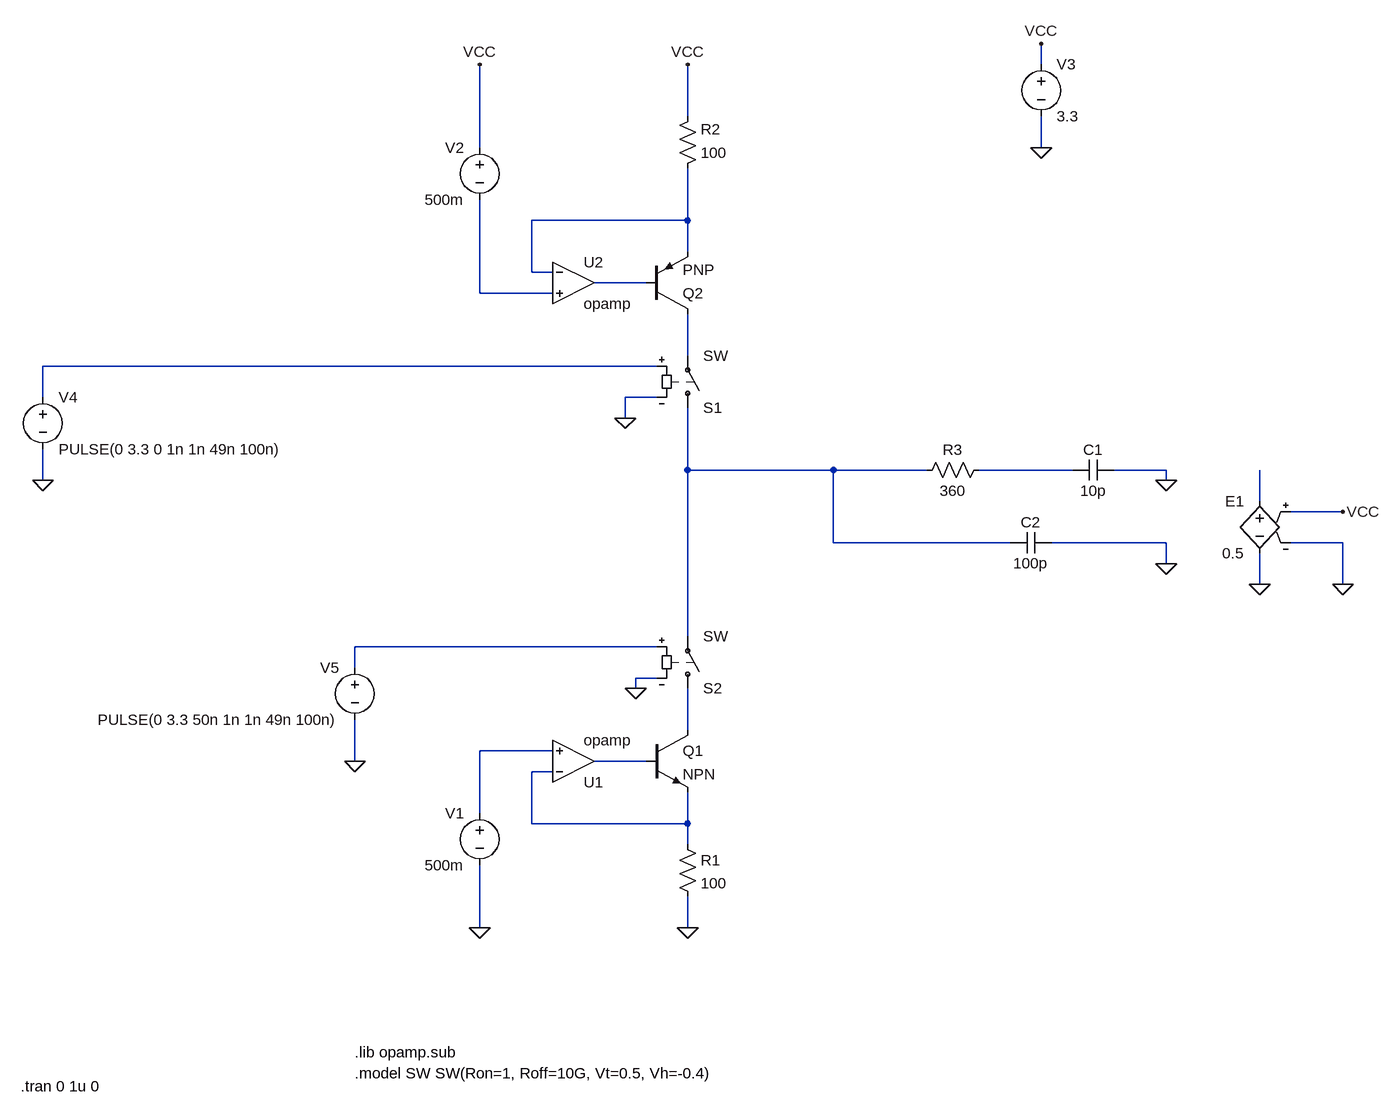
[diagram p0: schematic Type_II_PFD_Sim_Transient.asc]
Type_II_PFD_Sim_Transient.asc, the LTspice schematic file:
Version 4
SHEET 1 1520 692
WIRE 992 -896 992 -928
WIRE 448 -816 448 -896
WIRE 128 -768 128 -896
WIRE 992 -768 992 -816
WIRE 448 -656 448 -736
WIRE 448 -656 208 -656
WIRE 448 -608 448 -656
WIRE 208 -576 208 -656
WIRE 240 -576 208 -576
WIRE 384 -560 304 -560
WIRE 128 -544 128 -688
WIRE 240 -544 128 -544
WIRE 448 -448 448 -512
WIRE 400 -432 -544 -432
WIRE -544 -384 -544 -432
WIRE 400 -384 352 -384
WIRE 352 -352 352 -384
WIRE 448 -272 448 -368
WIRE 672 -272 448 -272
WIRE 816 -272 672 -272
WIRE 1040 -272 896 -272
WIRE 1184 -272 1104 -272
WIRE -544 -256 -544 -304
WIRE 1184 -256 1184 -272
WIRE 1328 -224 1328 -272
WIRE 1456 -208 1376 -208
WIRE 672 -160 672 -272
WIRE 944 -160 672 -160
WIRE 1184 -160 1008 -160
WIRE 1456 -160 1376 -160
WIRE 1184 -128 1184 -160
WIRE 1328 -96 1328 -144
WIRE 1456 -96 1456 -160
WIRE 448 -16 448 -272
WIRE 400 0 -64 0
WIRE -64 32 -64 0
WIRE 400 48 368 48
WIRE 368 64 368 48
WIRE 448 128 448 64
WIRE 240 160 128 160
WIRE -64 176 -64 112
WIRE 384 176 304 176
WIRE 240 192 208 192
WIRE 128 256 128 160
WIRE 208 272 208 192
WIRE 448 272 448 224
WIRE 448 272 208 272
WIRE 448 304 448 272
WIRE 128 432 128 336
WIRE 448 432 448 384
FLAG 448 432 0
FLAG 128 432 0
FLAG 128 -896 VCC
FLAG 448 -896 VCC
FLAG 992 -768 0
FLAG 992 -928 VCC
FLAG 1328 -96 0
FLAG 1456 -96 0
FLAG 1456 -208 VCC
FLAG 352 -352 0
FLAG 368 64 0
FLAG -544 -256 0
FLAG -64 176 0
FLAG 1184 -256 0
FLAG 1184 -128 0
SYMBOL Opamps\\opamp 272 240 M180
SYMATTR InstName U1
SYMATTR SpiceLine Aol=10Meg
SYMATTR SpiceLine2 GBW=10G
SYMBOL npn 384 128 R0
SYMATTR InstName Q1
SYMBOL res 432 288 R0
SYMATTR InstName R1
SYMATTR Value 100
SYMBOL voltage 128 240 M0
WINDOW 123 0 0 Left 0
WINDOW 39 0 0 Left 0
SYMATTR InstName V1
SYMATTR Value 500m
SYMBOL Opamps\\opamp 272 -624 R0
SYMATTR InstName U2
SYMATTR SpiceLine Aol=10Meg
SYMATTR SpiceLine2 GBW=10G
SYMBOL res 432 -720 M180
WINDOW 0 36 76 Left 2
WINDOW 3 36 40 Left 2
SYMATTR InstName R2
SYMATTR Value 100
SYMBOL voltage 128 -784 M0
WINDOW 123 0 0 Left 0
WINDOW 39 0 0 Left 0
SYMATTR InstName V2
SYMATTR Value 500m
SYMBOL pnp 384 -512 M180
SYMATTR InstName Q2
SYMBOL sw 448 -352 M180
SYMATTR InstName S1
SYMBOL sw 448 80 M180
SYMATTR InstName S2
SYMBOL voltage 992 -912 R0
SYMATTR InstName V3
SYMATTR Value 3.3
SYMBOL e 1328 -240 M0
SYMATTR InstName E1
SYMATTR Value 0.5
SYMBOL voltage -544 -400 R0
WINDOW 123 0 0 Left 0
WINDOW 39 0 0 Left 0
SYMATTR InstName V4
SYMATTR Value PULSE(0 3.3 0 1n 1n 49n 100n)
SYMBOL voltage -64 16 M0
WINDOW 123 0 0 Left 0
WINDOW 39 0 0 Left 0
SYMATTR InstName V5
SYMATTR Value PULSE(0 3.3 50n 1n 1n 49n 100n)
SYMBOL res 800 -256 R270
WINDOW 0 32 56 VTop 2
WINDOW 3 0 56 VBottom 2
SYMATTR InstName R3
SYMATTR Value 360
SYMBOL cap 1104 -288 R90
WINDOW 0 0 32 VBottom 2
WINDOW 3 32 32 VTop 2
SYMATTR InstName C1
SYMATTR Value 10p
SYMBOL cap 1008 -176 R90
WINDOW 0 0 32 VBottom 2
WINDOW 3 32 32 VTop 2
SYMATTR InstName C2
SYMATTR Value 100p
TEXT -64 624 Left 2 !.lib opamp.sub
TEXT -64 656 Left 2 !.model SW SW(Ron=1, Roff=10G, Vt=0.5, Vh=-0.4)
TEXT -578 676 Left 2 !.tran 0 1u 0

The netlist it stands for:
* Type_II_PFD_Sim_Transient.asc
XU1 N013 N011 N012 opamp Aol=10Meg GBW=10G  ; pins invin noninvin out
Q1 N010 N012 N013 0 NPN
R1 N013 0 100
V1 N011 0 500m
XU2 N001 N003 N002 opamp Aol=10Meg GBW=10G  ; pins invin noninvin out
R2 N001 VCC 100
V2 VCC N003 500m
Q2 N004 N002 N001 0 PNP
S1 N006 N004 N005 0 SW
S2 N010 N006 N009 0 SW
V3 VCC 0 3.3
E1 N008 0 VCC 0 0.5
V4 N005 0 PULSE(0 3.3 0 1n 1n 49n 100n)
V5 N009 0 PULSE(0 3.3 50n 1n 1n 49n 100n)
R3 N006 N007 360
C1 0 N007 10p
C2 0 N006 100p
.model NPN NPN
.model PNP PNP
.lib standard.bjt
.lib opamp.sub
.model SW SW(Ron=1, Roff=10G, Vt=0.5, Vh=-0.4)
.tran 0 1u 0
.backanno
.end